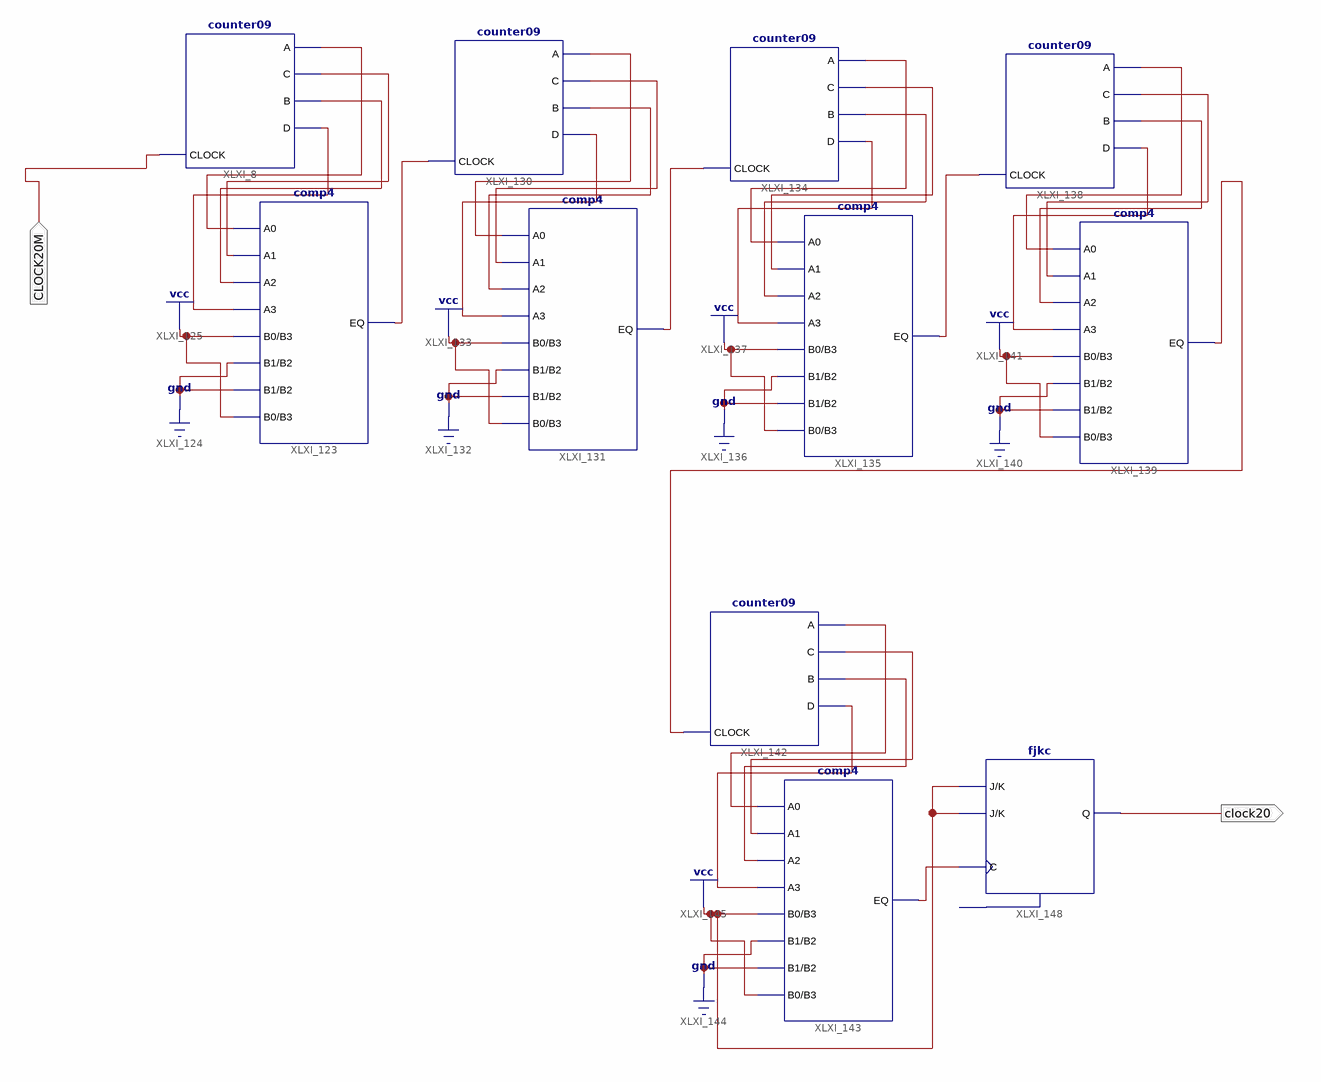
[diagram p0: schematic sheet 1]
// Xilinx ISE schematic frequencyDevider.sch (spartan6) as structural Verilog: 11 symbols, 2 ports
module frequencyDevider (
  input  CLOCK20M,
  output clock20
);

  wire XLXN_539, XLXN_540, XLXN_541, XLXN_542, XLXN_571, XLXN_585, XLXN_587, XLXN_589, XLXN_591, XLXN_594,
       XLXN_596, XLXN_598, XLXN_600, XLXN_602, XLXN_605, XLXN_607, XLXN_609, XLXN_611, XLXN_613, XLXN_617,
       XLXN_619, XLXN_621, XLXN_623, XLXN_625, XLXN_640;

  counter09 XLXI_8 (.CLOCK(CLOCK20M), .A(XLXN_539), .C(XLXN_540), .B(XLXN_541), .D(XLXN_542));
  comp4 XLXI_123 (
    .A0(XLXN_539), .A1(XLXN_540), .A2(XLXN_541), .A3(XLXN_542), .B0(1'b1), .B1(1'b0), .B2(1'b0), .B3(1'b1),
    .EQ(XLXN_571));
  counter09 XLXI_130 (.CLOCK(XLXN_571), .A(XLXN_589), .C(XLXN_585), .B(XLXN_587), .D(XLXN_591));
  comp4 XLXI_131 (
    .A0(XLXN_589), .A1(XLXN_585), .A2(XLXN_587), .A3(XLXN_591), .B0(1'b1), .B1(1'b0), .B2(1'b0), .B3(1'b1),
    .EQ(XLXN_594));
  counter09 XLXI_134 (.CLOCK(XLXN_594), .A(XLXN_600), .C(XLXN_596), .B(XLXN_598), .D(XLXN_602));
  comp4 XLXI_135 (
    .A0(XLXN_600), .A1(XLXN_596), .A2(XLXN_598), .A3(XLXN_602), .B0(1'b1), .B1(1'b0), .B2(1'b0), .B3(1'b1),
    .EQ(XLXN_605));
  counter09 XLXI_138 (.CLOCK(XLXN_605), .A(XLXN_611), .C(XLXN_607), .B(XLXN_609), .D(XLXN_613));
  comp4 XLXI_139 (
    .A0(XLXN_611), .A1(XLXN_607), .A2(XLXN_609), .A3(XLXN_613), .B0(1'b1), .B1(1'b0), .B2(1'b0), .B3(1'b1),
    .EQ(XLXN_617));
  counter09 XLXI_142 (.CLOCK(XLXN_617), .A(XLXN_623), .C(XLXN_619), .B(XLXN_621), .D(XLXN_625));
  comp4 XLXI_143 (
    .A0(XLXN_623), .A1(XLXN_619), .A2(XLXN_621), .A3(XLXN_625), .B0(1'b1), .B1(1'b0), .B2(1'b0), .B3(1'b1),
    .EQ(XLXN_640));
  fjkc XLXI_148 (.C(XLXN_640), .J(1'b1), .K(1'b1), .Q(clock20));  // open: CLR
endmodule
